# Altium project bolid.PrjPcb (part 2 of 6)

## Sheet bolid-inputs-digital.SchDoc
size A3
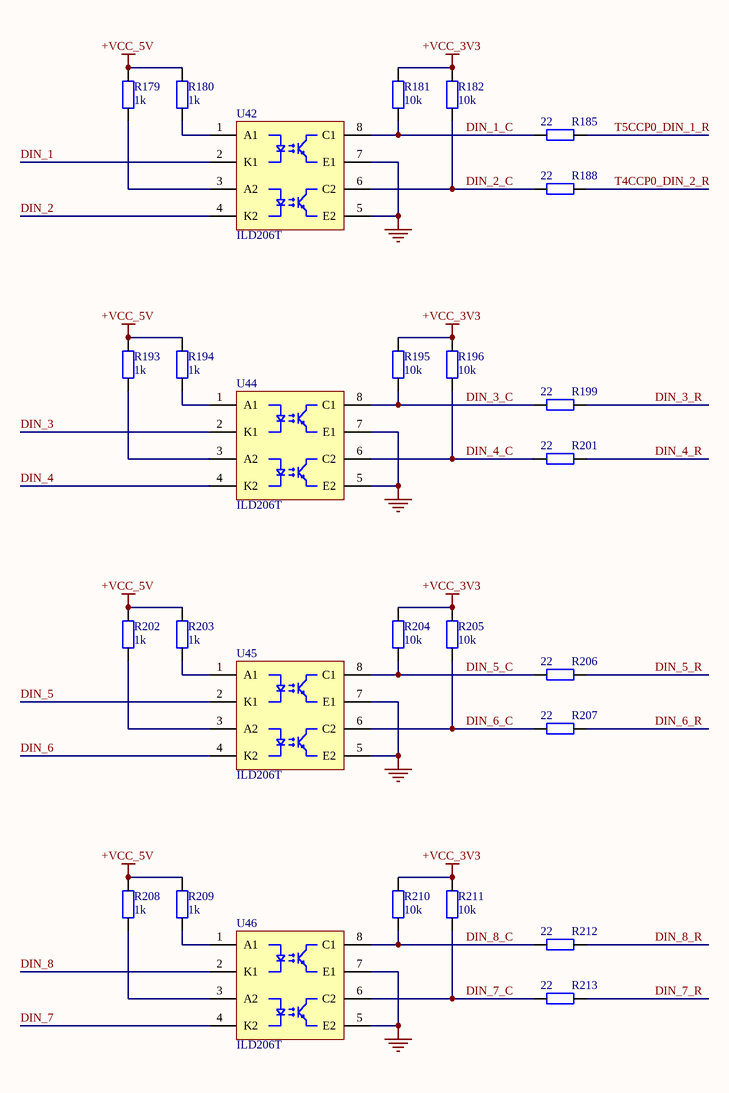
[diagram p2: bolid-inputs-digital.SchDoc]

### Parts
R179  value 1k  [R0402-RESC100X50X40L22N]  (hidden comment: RC0402FR-071KL)
R180  value 1k  [R0402-RESC100X50X40L22N]  (hidden comment: RC0402FR-071KL)
R181  value 10k  [R0402-RESC100X50X40L22N]  (hidden comment: RC0402FR-0710KL)
R182  value 10k  [R0402-RESC100X50X40L22N]  (hidden comment: RC0402FR-0710KL)
R185  value 22  [R0402-RESC100X50X40L22N]  (hidden comment: RC0402FR-1322RL)
R188  value 22  [R0402-RESC100X50X40L22N]  (hidden comment: RC0402FR-1322RL)
R193  value 1k  [R0402-RESC100X50X40L22N]  (hidden comment: RC0402FR-071KL)
R194  value 1k  [R0402-RESC100X50X40L22N]  (hidden comment: RC0402FR-071KL)
R195  value 10k  [R0402-RESC100X50X40L22N]  (hidden comment: RC0402FR-0710KL)
R196  value 10k  [R0402-RESC100X50X40L22N]  (hidden comment: RC0402FR-0710KL)
R199  value 22  [R0402-RESC100X50X40L22N]  (hidden comment: RC0402FR-1322RL)
R201  value 22  [R0402-RESC100X50X40L22N]  (hidden comment: RC0402FR-1322RL)
R202  value 1k  [R0402-RESC100X50X40L22N]  (hidden comment: RC0402FR-071KL)
R203  value 1k  [R0402-RESC100X50X40L22N]  (hidden comment: RC0402FR-071KL)
R204  value 10k  [R0402-RESC100X50X40L22N]  (hidden comment: RC0402FR-0710KL)
R205  value 10k  [R0402-RESC100X50X40L22N]  (hidden comment: RC0402FR-0710KL)
R206  value 22  [R0402-RESC100X50X40L22N]  (hidden comment: RC0402FR-1322RL)
R207  value 22  [R0402-RESC100X50X40L22N]  (hidden comment: RC0402FR-1322RL)
R208  value 1k  [R0402-RESC100X50X40L22N]  (hidden comment: RC0402FR-071KL)
R209  value 1k  [R0402-RESC100X50X40L22N]  (hidden comment: RC0402FR-071KL)
R210  value 10k  [R0402-RESC100X50X40L22N]  (hidden comment: RC0402FR-0710KL)
R211  value 10k  [R0402-RESC100X50X40L22N]  (hidden comment: RC0402FR-0710KL)
R212  value 22  [R0402-RESC100X50X40L22N]  (hidden comment: RC0402FR-1322RL)
R213  value 22  [R0402-RESC100X50X40L22N]  (hidden comment: RC0402FR-1322RL)
U42  ILD206T  [Vishay SOIC8 ILD SOIC8P127_600X610X395L51X41]
U44  ILD206T  [Vishay SOIC8 ILD SOIC8P127_600X610X395L51X41]
U45  ILD206T  [Vishay SOIC8 ILD SOIC8P127_600X610X395L51X41]
U46  ILD206T  [Vishay SOIC8 ILD SOIC8P127_600X610X395L51X41]

### Nets
+VCC_3V3: R181.2 R182.2 R195.2 R196.2 R204.2 R205.2 R210.2 R211.2
+VCC_5V: R179.2 R180.2 R193.2 R194.2 R202.2 R203.2 R208.2 R209.2
GND: U42.5(E2) U42.7(E1) U44.5(E2) U44.7(E1) U45.5(E2) U45.7(E1) U46.5(E2) U46.7(E1)
DIN_1: U42.2(K1)
DIN_1_C: R181.1 R185.1 U42.8(C1)
DIN_2: U42.4(K2)
DIN_2_C: R182.1 R188.1 U42.6(C2)
DIN_3: U44.2(K1)
DIN_3_C: R195.1 R199.1 U44.8(C1)
DIN_3_R: R199.2
DIN_4: U44.4(K2)
DIN_4_C: R196.1 R201.1 U44.6(C2)
DIN_4_R: R201.2
DIN_5: U45.2(K1)
DIN_5_C: R204.1 R206.1 U45.8(C1)
DIN_5_R: R206.2
DIN_6: U45.4(K2)
DIN_6_C: R205.1 R207.1 U45.6(C2)
DIN_6_R: R207.2
DIN_7: U46.4(K2)
DIN_7_C: R211.1 R213.1 U46.6(C2)
DIN_7_R: R213.2
DIN_8: U46.2(K1)
DIN_8_C: R210.1 R212.1 U46.8(C1)
DIN_8_R: R212.2
T4CCP0_DIN_2_R: R188.2
T5CCP0_DIN_1_R: R185.2
NetR179_1: R179.1 U42.3(A2)
NetR180_1: R180.1 U42.1(A1)
NetR193_1: R193.1 U44.3(A2)
NetR194_1: R194.1 U44.1(A1)
NetR202_1: R202.1 U45.3(A2)
NetR203_1: R203.1 U45.1(A1)
NetR208_1: R208.1 U46.3(A2)
NetR209_1: R209.1 U46.1(A1)

### Library data of the parts
R179 R180 R193 R194 R202 R203 R208 R209 = RC0402FR-071KL: RES 0402 (1005) 1.00k 1% 0.0625W 50V Thick Film; Manufacturer: Yageo; Power Rating: 62.5 mW, 125 mW; Resistance: 1 kOhms; Temperature Coefficient: 100 PPM / C; Supplier 1: Mouser; Manufacturer Part Number: RC0402FR-071KL; RoHS: RoHS Compliant; Category: Thick Film Resistors - SMD; Stock 1: 18776448; Pricing 1: 1=0.090, 10=0.011, 100=0.004, 1000=0.003, 10000=0.003 (EUR); Application: High Reliability; Features: -; Height: 0.35 mm; Length: 1 mm; Package / Case: -; Packaging: Cut Tape; Product: Thick Film Resistors SMD; Series: RC; Technology: Thick Film; Termination Style: SMD/SMT; Tolerance: 1 %; Type: General Purpose; Voltage Rating: 50 V; Width: 0.5 mm; Brand: Yageo; Mounting Style: PCB Mount; Case Code - in: 0402; Case Code - mm: 1005; Maximum Operating Temperature: + 155 C; Minimum Operating Temperature: - 55 C; Product Type: Thick Film Resistors; Standard Pack Qty: 10000; Subcategory: Resistors; RoHS - Mouser: Y; Minimum Order Quantity: 1; Reeling: True; ComponentLink1URL: https://www.mouser.com/datasheet/2/447/PYu-RC_Group_51_RoHS_L_10-1664068.pdf; ComponentLink1Description: https://www.mouser.com/datasheet/2/447/PYu-RC_Group_51_RoHS_L_10-1664068.pdf; Supplier Part Number 1: 603-RC0402FR-071KL
R181 R182 R195 R196 R204 R205 R210 R211 = RC0402FR-0710KL: RES 0402 (1005) 10.0k 1% 0.0625W 50V Thick Film; Manufacturer: Yageo; Power Rating: 62.5 mW, 125 mW; Resistance: 10 kOhms; Temperature Coefficient: 100 PPM / C; Supplier 1: Mouser; Manufacturer Part Number: RC0402FR-0710KL; RoHS: RoHS Compliant; Category: Thick Film Resistors - SMD; Stock 1: 20942447; Pricing 1: 1=0.090, 10=0.011, 100=0.004, 1000=0.003, 10000=0.003 (EUR); Application: High Reliability; Features: -; Height: 0.35 mm; Length: 1 mm; Package / Case: -; Packaging: Cut Tape; Product: Thick Film Resistors SMD; Series: RC; Technology: Thick Film; Termination Style: SMD/SMT; Tolerance: 1 %; Type: General Purpose; Voltage Rating: 50 V; Width: 0.5 mm; Brand: Yageo; Mounting Style: PCB Mount; Case Code - in: 0402; Case Code - mm: 1005; Maximum Operating Temperature: + 155 C; Minimum Operating Temperature: - 55 C; Product Type: Thick Film Resistors; Standard Pack Qty: 10000; Subcategory: Resistors; RoHS - Mouser: Y; Minimum Order Quantity: 1; Reeling: True; ComponentLink1URL: https://www.mouser.com/datasheet/2/447/PYu-RC_Group_51_RoHS_L_10-1664068.pdf; ComponentLink1Description: https://www.mouser.com/datasheet/2/447/PYu-RC_Group_51_RoHS_L_10-1664068.pdf; Supplier Part Number 1: 603-RC0402FR-0710KL
R185 R188 R199 R201 R206 R207 R212 R213 = RC0402FR-1322RL: RES 0402 (1005) 22.0 ohm 1% 0.0625W 50V Thick Film; Manufacturer: Yageo; Resistance: 22R; Power Rating: 62.5mW; Temperature Coefficient: 100ppm/°C; Supplier 1: Mouser; Manufacturer Part Number: RC0402FR-1322RL; RoHS: Yes; Category: Chip SMD Resistors; Stock 1: 130563; Pricing 1: 1=0,10000, 10=0,01200, 50=0,01200, 100=0,00500, 1000=0,00300, 10000=0,00300 (USD); Case/Package: 0402; Case Code (Imperial): 0402; Case Code (Metric): 1005; Weight: 2.3E-05oz; Contact Plating: Tin,Matte; Size Code: 0402; Min Operating Temperature: -55°C; Max Operating Temperature: 155°C; Voltage Rating: 50V; Tolerance: 1%; Packaging: Tape and Reel; Resistor Type: Thick Film; Termination: SMD/SMT; Series: RC; Length: 1mm; Width: 0.5mm; Height: 0.35mm; Radiation Hardening: No; Lead Free: Lead Free; RoHS Compliant: Yes; ComponentLink1URL: https://datasheet.ciiva.com/17423/pyu-rc0402-51-rohs-l-6-r-17423721.pdf?src-supplier=Future+Electronics; ComponentLink1Description: https://datasheet.ciiva.com/17423/pyu-rc0402-51-rohs-l-6-r-17423721.pdf?src-supplier=Future+Electronics; ComponentLink2URL: https://datasheet.ciiva.com/8890/pyu-rc0402-51-rohs-l-6-8890187.pdf?src-supplier=Avnet; ComponentLink2Description: https://datasheet.ciiva.com/8890/pyu-rc0402-51-rohs-l-6-8890187.pdf?src-supplier=Avnet; Supplier Part Number 1: 603-RC0402FR-1322RL
U42 U44-U46 = ILD206T: Transistor Output Optocouplers Phototransistor Out Dual CTR 63-125%; Manufacturer: Vishay Semiconductors; Configuration: 2 Channel; Isolation Voltage: 4000 Vrms; Output Type: NPN Phototransistor; Collector-Emitter Breakdown Voltage: 70 V; Current Transfer Ratio: 125 %; If - Forward Current: 30 mA; Maximum Collector Emitter Saturation Voltage: 0.4 V; Pd - Power Dissipation: 300 mW; Vf - Forward Voltage: 1.55 V; Vr - Reverse Voltage: 6 V; Supplier 1: Mouser; Manufacturer Part Number: ILD206T; RoHS: RoHS Compliant; Category: Transistor Output Optocouplers; Stock 1: 3481; Pricing 1: 1=1.22, 10=0.834, 100=0.625, 500=0.512, 1000=0.443, 2000=0.404, 4000=0.394 (EUR); Height: 3.38 mm; Length: 5.84 mm; Package / Case: SOIC-8; Packaging: Cut Tape; Width: 3.91 mm; Brand: Vishay Semiconductors; Mounting Style: SMD/SMT; Number of Channels: 2 Channel; Maximum Collector Emitter Voltage: 70 V; Maximum Operating Temperature: + 100 C; Minimum Operating Temperature: - 55 C; Product Type: Transistor Output Optocouplers; Standard Pack Qty: 2000; Subcategory: Optocouplers; RoHS - Mouser: Y; Minimum Order Quantity: 1; Reeling: True; ComponentLink1URL: https://www.mouser.com/datasheet/2/427/ild205t-244792.pdf; ComponentLink1Description: https://www.mouser.com/datasheet/2/427/ild205t-244792.pdf; Supplier Part Number 1: 782-ILD206T

## Sheet bolid-inputs-hv.SchDoc
size A3
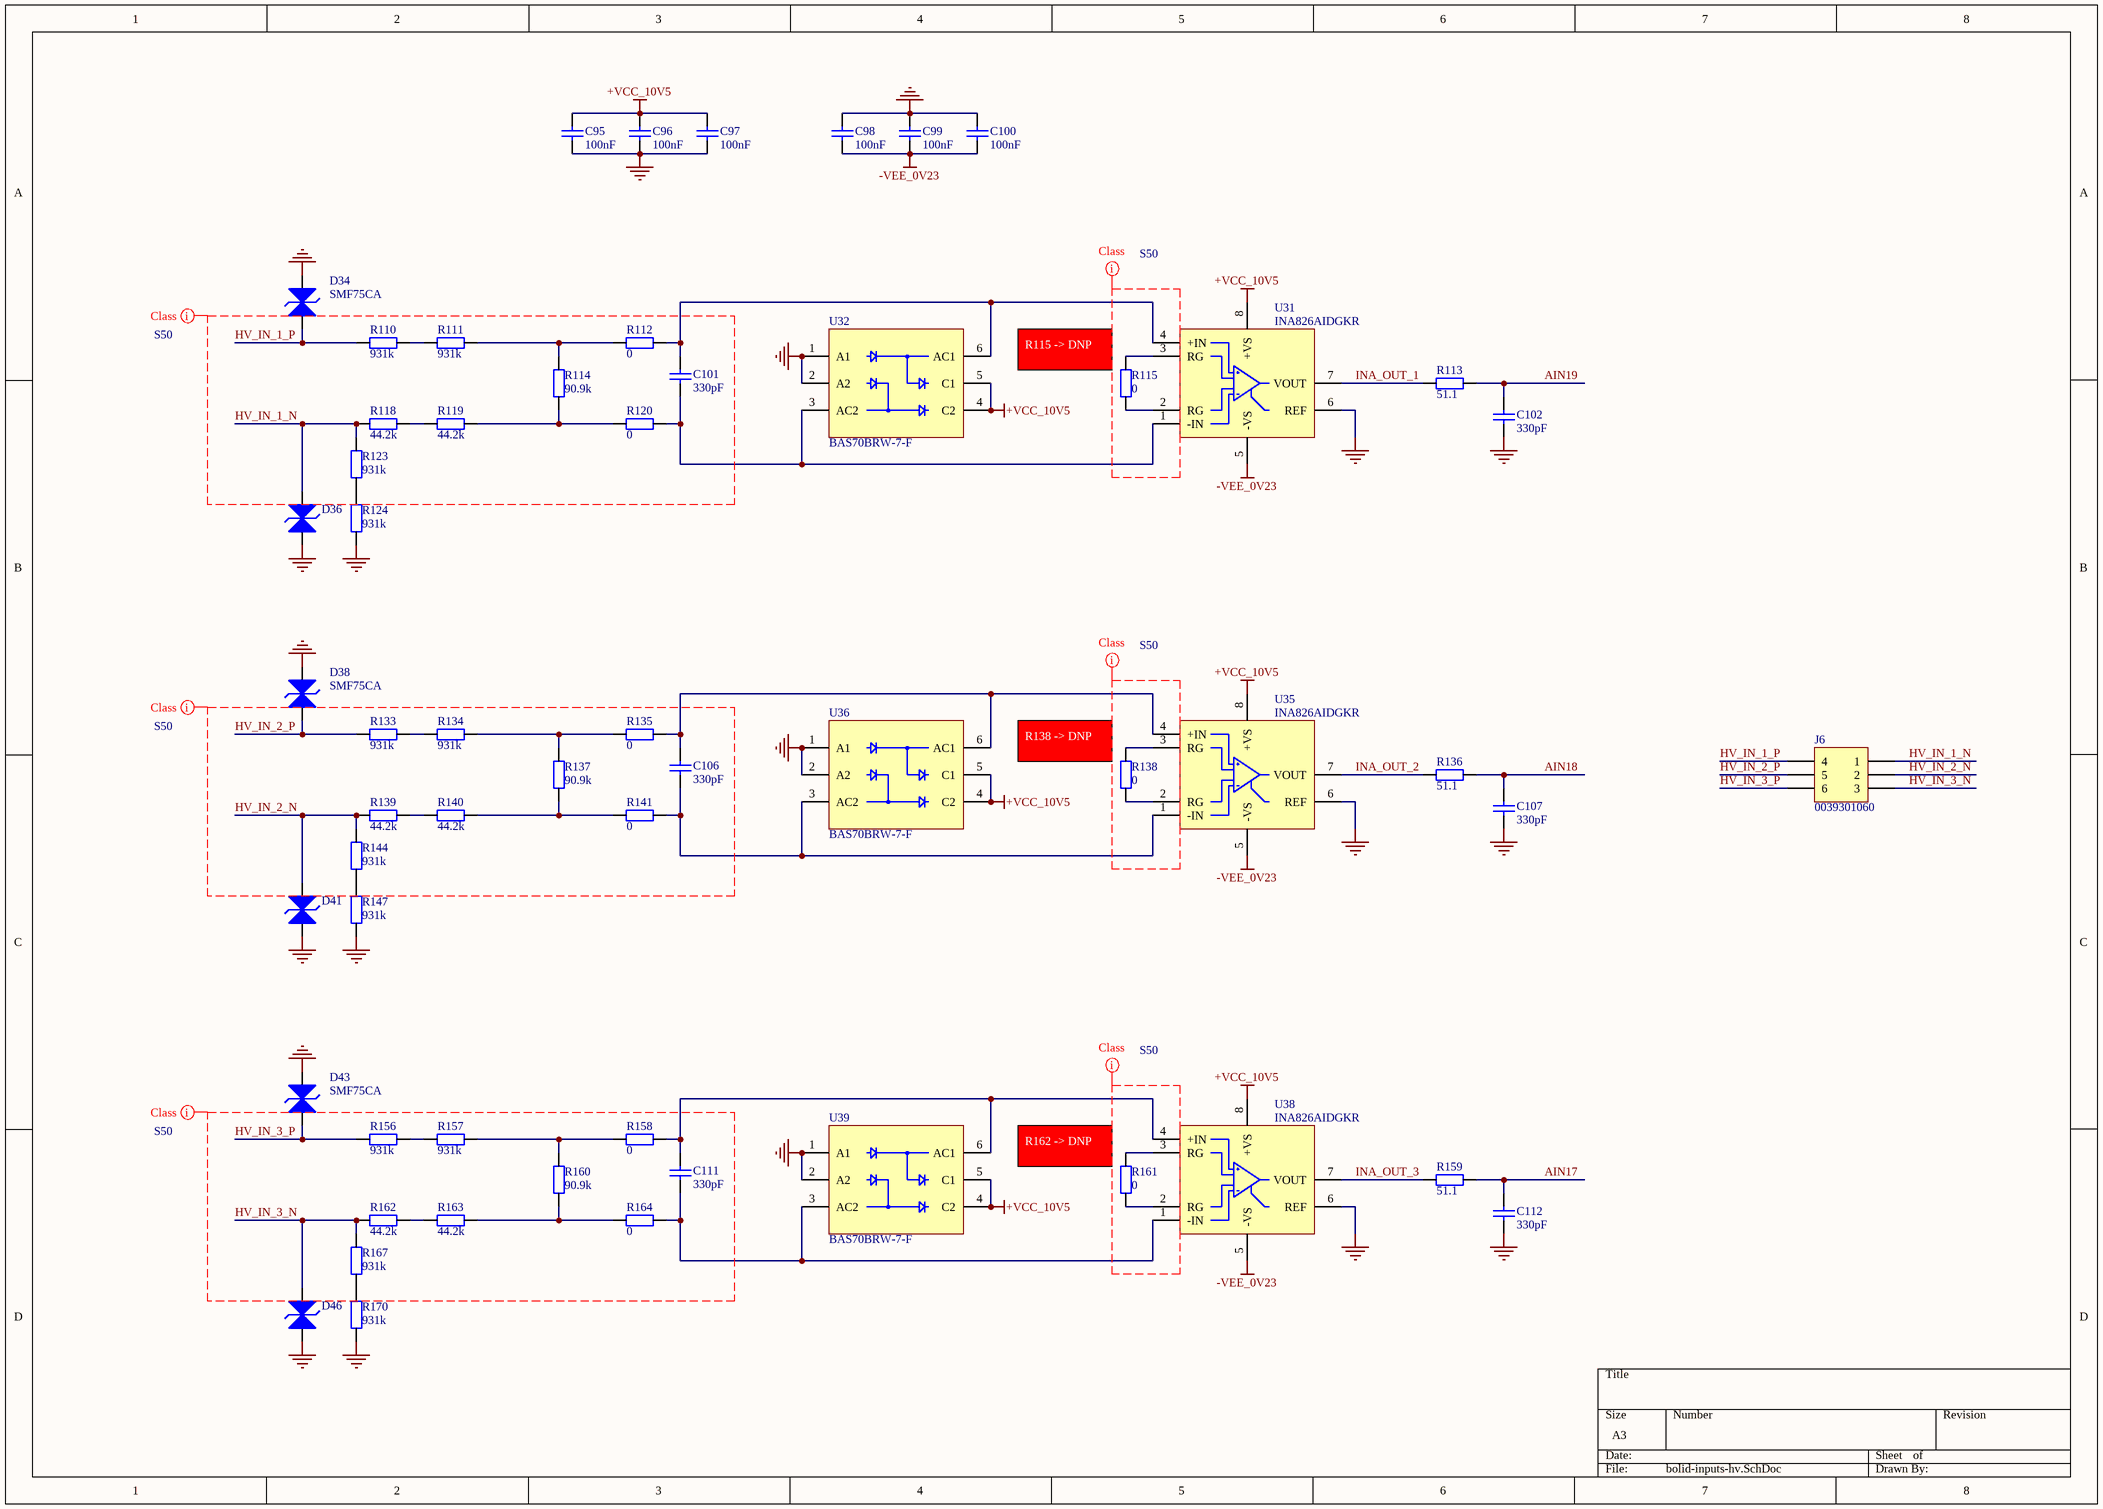
[diagram p3: bolid-inputs-hv.SchDoc]

### Parts
C95  Value Displayed: 100nF  [C0402-CAPC100X50X55L22 - Tayio Yuden TDK]  (hidden comment: GRM155R71H104KE14D)
C96  Value Displayed: 100nF  [C0402-CAPC100X50X55L22 - Tayio Yuden TDK]  (hidden comment: GRM155R71H104KE14D)
C97  Value Displayed: 100nF  [C0402-CAPC100X50X55L22 - Tayio Yuden TDK]  (hidden comment: GRM155R71H104KE14D)
C98  Value Displayed: 100nF  [C0402-CAPC100X50X55L22 - Tayio Yuden TDK]  (hidden comment: GRM155R71H104KE14D)
C99  Value Displayed: 100nF  [C0402-CAPC100X50X55L22 - Tayio Yuden TDK]  (hidden comment: GRM155R71H104KE14D)
C100  Value Displayed: 100nF  [C0402-CAPC100X50X55L22 - Tayio Yuden TDK]  (hidden comment: GRM155R71H104KE14D)
C101  Value Displayed: 330pF  [C0402-CAPC100X50X55L22 - Tayio Yuden TDK]  (hidden comment: C0402C331J5GAC)
C102  Value Displayed: 330pF  [C0402-CAPC100X50X55L22 - Tayio Yuden TDK]  (hidden comment: C0402C331J5GAC)
C106  Value Displayed: 330pF  [C0402-CAPC100X50X55L22 - Tayio Yuden TDK]  (hidden comment: C0402C331J5GAC)
C107  Value Displayed: 330pF  [C0402-CAPC100X50X55L22 - Tayio Yuden TDK]  (hidden comment: C0402C331J5GAC)
C111  Value Displayed: 330pF  [C0402-CAPC100X50X55L22 - Tayio Yuden TDK]  (hidden comment: C0402C331J5GAC)
C112  Value Displayed: 330pF  [C0402-CAPC100X50X55L22 - Tayio Yuden TDK]  (hidden comment: C0402C331J5GAC)
D34  SMF75CA  [SOD-123FL SODFL365X110-2N - BIDIRECTIONAL - Littelfuse]
D36  SMF75CA  [SOD-123FL SODFL365X110-2N - BIDIRECTIONAL - Littelfuse]  (value not drawn)
D38  SMF75CA  [SOD-123FL SODFL365X110-2N - BIDIRECTIONAL - Littelfuse]
D41  SMF75CA  [SOD-123FL SODFL365X110-2N - BIDIRECTIONAL - Littelfuse]  (value not drawn)
D43  SMF75CA  [SOD-123FL SODFL365X110-2N - BIDIRECTIONAL - Littelfuse]
D46  SMF75CA  [SOD-123FL SODFL365X110-2N - BIDIRECTIONAL - Littelfuse]  (value not drawn)
J6  0039301060  [MOLEX Mini-Fit Jr 039301060 2x3 PEG]
R110  value 931k  [R0603-RESC160X80X55L30N]  (hidden comment: RC0603FR-07931KL)
R111  value 931k  [R0603-RESC160X80X55L30N]  (hidden comment: RC0603FR-07931KL)
R112  value 0  [R0402-RESC100X50X40L22N]  (hidden comment: RC0402JR-7D0RL)
R113  value 51.1  [R0402-RESC100X50X40L22N]  (hidden comment: AC0402FR-0751R1L)
R114  value 90.9k  [R0402-RESC100X50X40L22N]  (hidden comment: RC0402FR-0790K9L)
R115  value 0  [R0402-RESC100X50X40L22N]  (hidden comment: RC0402JR-7D0RL)
R118  value 44.2k  [R0603-RESC160X80X55L30N]  (hidden comment: RC0603FR-0744K2L)
R119  value 44.2k  [R0603-RESC160X80X55L30N]  (hidden comment: RC0603FR-0744K2L)
R120  value 0  [R0402-RESC100X50X40L22N]  (hidden comment: RC0402JR-7D0RL)
R123  value 931k  [R0603-RESC160X80X55L30N]  (hidden comment: RC0603FR-07931KL)
R124  value 931k  [R0603-RESC160X80X55L30N]  (hidden comment: RC0603FR-07931KL)
R133  value 931k  [R0603-RESC160X80X55L30N]  (hidden comment: RC0603FR-07931KL)
R134  value 931k  [R0603-RESC160X80X55L30N]  (hidden comment: RC0603FR-07931KL)
R135  value 0  [R0402-RESC100X50X40L22N]  (hidden comment: RC0402JR-7D0RL)
R136  value 51.1  [R0402-RESC100X50X40L22N]  (hidden comment: AC0402FR-0751R1L)
R137  value 90.9k  [R0402-RESC100X50X40L22N]  (hidden comment: RC0402FR-0790K9L)
R138  value 0  [R0402-RESC100X50X40L22N]  (hidden comment: RC0402JR-7D0RL)
R139  value 44.2k  [R0603-RESC160X80X55L30N]  (hidden comment: RC0603FR-0744K2L)
R140  value 44.2k  [R0603-RESC160X80X55L30N]  (hidden comment: RC0603FR-0744K2L)
R141  value 0  [R0402-RESC100X50X40L22N]  (hidden comment: RC0402JR-7D0RL)
R144  value 931k  [R0603-RESC160X80X55L30N]  (hidden comment: RC0603FR-07931KL)
R147  value 931k  [R0603-RESC160X80X55L30N]  (hidden comment: RC0603FR-07931KL)
R156  value 931k  [R0603-RESC160X80X55L30N]  (hidden comment: RC0603FR-07931KL)
R157  value 931k  [R0603-RESC160X80X55L30N]  (hidden comment: RC0603FR-07931KL)
R158  value 0  [R0402-RESC100X50X40L22N]  (hidden comment: RC0402JR-7D0RL)
R159  value 51.1  [R0402-RESC100X50X40L22N]  (hidden comment: AC0402FR-0751R1L)
R160  value 90.9k  [R0402-RESC100X50X40L22N]  (hidden comment: RC0402FR-0790K9L)
R161  value 0  [R0402-RESC100X50X40L22N]  (hidden comment: RC0402JR-7D0RL)
R162  value 44.2k  [R0603-RESC160X80X55L30N]  (hidden comment: RC0603FR-0744K2L)
R163  value 44.2k  [R0603-RESC160X80X55L30N]  (hidden comment: RC0603FR-0744K2L)
R164  value 0  [R0402-RESC100X50X40L22N]  (hidden comment: RC0402JR-7D0RL)
R167  value 931k  [R0603-RESC160X80X55L30N]  (hidden comment: RC0603FR-07931KL)
R170  value 931k  [R0603-RESC160X80X55L30N]  (hidden comment: RC0603FR-07931KL)
U31  INA826AIDGKR  [TI VSSOP8 DGK0008A TSOP65P490X110-8N]
U32  BAS70BRW-7-F  [SOT363 DIODES DS30158 Rev. 14-2 SOT65P210X110-6N]
U35  INA826AIDGKR  [TI VSSOP8 DGK0008A TSOP65P490X110-8N]
U36  BAS70BRW-7-F  [SOT363 DIODES DS30158 Rev. 14-2 SOT65P210X110-6N]
U38  INA826AIDGKR  [TI VSSOP8 DGK0008A TSOP65P490X110-8N]
U39  BAS70BRW-7-F  [SOT363 DIODES DS30158 Rev. 14-2 SOT65P210X110-6N]

### Nets
+VCC_10V5: C95.2 C96.2 C97.2 U31.8(+VS) U32.4(C2) U32.5(C1) U35.8(+VS) U36.4(C2) U36.5(C1) U38.8(+VS) U39.4(C2) U39.5(C1)
-VEE_0V23: C98.1 C99.1 C100.1 U31.5(-VS) U35.5(-VS) U38.5(-VS)
GND: C95.1 C96.1 C97.1 C98.2 C99.2 C100.2 C102.1 C107.1 C112.1 D34.2 D36.1 D38.2 D41.1 D43.2 D46.1 R124.1 R147.1 R170.1 U31.6(REF) U32.1(A1) U32.2(A2) U35.6(REF) U36.1(A1) U36.2(A2) U38.6(REF) U39.1(A1) U39.2(A2)
AIN17: C112.2 R159.2
AIN18: C107.2 R136.2
AIN19: C102.2 R113.2
HV_IN_1_N: D36.2 J6.1 R118.1 R123.2
HV_IN_1_P: D34.1 J6.4 R110.1
HV_IN_2_N: D41.2 J6.2 R139.1 R144.2
HV_IN_2_P: D38.1 J6.5 R133.1
HV_IN_3_N: D46.2 J6.3 R162.1 R167.2
HV_IN_3_P: D43.1 J6.6 R156.1
INA_OUT_1: R113.1 U31.7(VOUT)
INA_OUT_2: R136.1 U35.7(VOUT)
INA_OUT_3: R159.1 U38.7(VOUT)
NetC101_1: C101.1 R120.1 U31.1(-IN) U32.3(AC2)
NetC101_2: C101.2 R112.1 U31.4(+IN) U32.6(AC1)
NetC106_1: C106.1 R141.1 U35.1(-IN) U36.3(AC2)
NetC106_2: C106.2 R135.1 U35.4(+IN) U36.6(AC1)
NetC111_1: C111.1 R164.1 U38.1(-IN) U39.3(AC2)
NetC111_2: C111.2 R158.1 U38.4(+IN) U39.6(AC1)
NetR110_2: R110.2 R111.1
NetR111_2: R111.2 R112.2 R114.2
NetR114_1: R114.1 R119.2 R120.2
NetR115_1: R115.1 U31.2(RG)
NetR115_2: R115.2 U31.3(RG)
NetR118_2: R118.2 R119.1
NetR123_1: R123.1 R124.2
NetR133_2: R133.2 R134.1
NetR134_2: R134.2 R135.2 R137.2
NetR137_1: R137.1 R140.2 R141.2
NetR138_1: R138.1 U35.2(RG)
NetR138_2: R138.2 U35.3(RG)
NetR139_2: R139.2 R140.1
NetR144_1: R144.1 R147.2
NetR156_2: R156.2 R157.1
NetR157_2: R157.2 R158.2 R160.2
NetR160_1: R160.1 R163.2 R164.2
NetR161_1: R161.1 U38.2(RG)
NetR161_2: R161.2 U38.3(RG)
NetR162_2: R162.2 R163.1
NetR167_1: R167.1 R170.2

### Layout directives
net class S50: (no net found under the mark), HV_IN_1_N, HV_IN_1_P, HV_IN_2_N, HV_IN_2_P, HV_IN_3_N, HV_IN_3_P

### Notes on the sheet
- (near R115) R115 -> DNP
- (near R138) R138 -> DNP
- (near R161) R162 -> DNP

### Library data of the parts
C95-C100 = GRM155R71H104KE14D: MLCC 0402 (1005) 100nF 10% 50V X7R; Manufacturer: Murata Electronics; Capacitance: 0.1 uF; Type: Chip Multilayer Ceramic Capacitor for General Purpose; Voltage Rating DC: 50 VDC; Capacitance - pF: 100000 pF; Class: Class 2; Supplier 1: Mouser; Manufacturer Part Number: GRM155R71H104KE14D; RoHS: RoHS Compliant; Category: Multilayer Ceramic Capacitors MLCC - SMD/SMT; Stock 1: 3511637; Pricing 1: 1=0.090, 10=0.038, 100=0.016, 500=0.012, 1000=0.009, 2500=0.008, 5000=0.007, 10000=0.005 (EUR); Height: 0.5 mm; Length: 1 mm; Package / Case: 0402 (1005 metric); Packaging: Cut Tape; Product: General Type MLCCs; Series: GRM; Termination Style: SMD/SMT; Tolerance: 10 %; Width: 0.5 mm; Brand: Murata Electronics; Capacitance - nF: 100 nF; Case Code - in: 0402; Case Code - mm: 1005; Dielectric: X7R; Maximum Operating Temperature: + 125 C; Minimum Operating Temperature: - 55 C; Product Type: Ceramic Capacitors; Standard Pack Qty: 10000; Subcategory: Capacitors; Termination: Standard; RoHS - Mouser: Y; Minimum Order Quantity: 1; Reeling: True; ComponentLink1URL: https://www.mouser.com/datasheet/2/281/murata_03052018_GRM_Series_1-1310166.pdf; ComponentLink1Description: https://www.mouser.com/datasheet/2/281/murata_03052018_GRM_Series_1-1310166.pdf; Value: 100nF; Supplier Part Number 1: 81-GRM155R71H104KE4D
C101 C102 C106 C107 C111 C112 = C0402C331J5GAC: MLCC 0402 (1005) 330pF 5% 50V C0G (N0P); Manufacturer: KEMET; Dielectric Material: Ceramic; Dissipation Factor: 0.1%; Value: 330p; Supplier 1: Mouser; Manufacturer Part Number: C0402C331J5GAC; RoHS: Yes; Category: Ceramic Capacitors; Stock 1: 30000; Pricing 1: 10000=0,08600 (USD); Case/Package: 0402; Case Code (Imperial): 0402; Case Code (Metric): 1005; Min Operating Temperature: -55°C; Max Operating Temperature: 125°C; Capacitance: 330pF; Voltage Rating (DC): 50V; Tolerance: 5%; Package Quantity: 10000; Voltage Rating: 50V; Packaging: Tape and Reel; Dielectric: C0G; Termination: SMD/SMT; Series: C0402C; Length: 1mm; Width: 0.5mm; Height: 0.5mm; Lead Free: Lead Free; RoHS Compliant: Yes; ComponentLink1URL: https://datasheet.ciiva.com/13387/kem-c1003-c0g-smd-356956-13387134.pdf?src-supplier=Mouser; ComponentLink1Description: https://datasheet.ciiva.com/13387/kem-c1003-c0g-smd-356956-13387134.pdf?src-supplier=Mouser; Supplier Part Number 1: 80-C0402C331J5GAC
D34 D36 D38 D41 D43 D46 = SMF75CA: Manufacturer: Littelfuse; Supplier 1: Mouser; Manufacturer Part Number: SMF75CA; RoHS: Yes; Stock 1: 3903; Pricing 1: 1=0,4, 10=0,271, 50=0,271, 100=0,134, 1000=0,121, 10000=0,098 (USD); Supplier Part Number 1: 576-SMF75CA
J6 = 039301060: Molex MiniFit Jr 2x3 Peg Rt Angle Header Tin Plate W/pcb Mount Peg 94V-2 6 Circuit | Molex Incorporated 39-30-1060; Supplier 1: Mouser; Manufacturer: Molex; Manufacturer Part Number: 0039301060; RoHS: Yes; Stock 1: 11572; Pricing 1: 1=0,89, 10=0,554, 50=0,554, 100=0,482, 1000=0,481, 10000=0,463 (USD); Supplier Part Number 1: 538-39-30-1060
R110 R111 R123 R124 R133 R134 R144 R147 R156 R157 R167 R170 = RC0603FR-07931KL: RES 0603 (1608) 931.0k 1% 0.100W 50V Thick Film; Manufacturer: Yageo; Supplier 1: Mouser; Manufacturer Part Number: RC0603FR-07931KL; RoHS: Yes; Category: Chip SMD Resistors; Stock 1: 15576; Pricing 1: 1=0,1, 10=0,01, 50=0,01, 100=0,007, 1000=0,005, 10000=0,004 (USD); Voltage Rating (DC): 50V; Lead Free: 5697LeadFree; ComponentLink1URL: https://datasheet.ciiva.com/2454/pyu-r-int-thick-7-2454555.pdf?src-supplier=Digikey; ComponentLink1Description: https://datasheet.ciiva.com/2454/pyu-r-int-thick-7-2454555.pdf?src-supplier=Digikey; ComponentLink2URL: https://datasheet.ciiva.com/2454/pyu-r-int-thick-7-2454556.pdf?src-supplier=Digikey; ComponentLink2Description: https://datasheet.ciiva.com/2454/pyu-r-int-thick-7-2454556.pdf?src-supplier=Digikey; ComponentLink3URL: https://datasheet.ciiva.com/2454/pyu-r-int-thick-7-2454557.pdf?src-supplier=Digikey; ComponentLink3Description: https://datasheet.ciiva.com/2454/pyu-r-int-thick-7-2454557.pdf?src-supplier=Digikey; ComponentLink4URL: https://datasheet.ciiva.com/12575/rc0603-272842-12575067.pdf?src-supplier=Mouser; ComponentLink4Description: https://datasheet.ciiva.com/12575/rc0603-272842-12575067.pdf?src-supplier=Mouser; Supplier Part Number 1: 603-RC0603FR-07931KL
R112 R115 R120 R135 R138 R141 R158 R161 R164 = RC0402JR-7D0RL: RES 0402 (1005) 0.00 ohm 1% 0.0625W 50V Thick Film; Manufacturer: Yageo; Resistance: 0mR; Tolerance: 5%; Supplier 1: Mouser; Manufacturer Part Number: RC0402JR-7D0RL; RoHS: Yes; Category: Chip SMD Resistors; Stock 1: 114874; Pricing 1: 1=0,10000, 10=0,01400, 50=0,01400, 100=0,00600, 1000=0,00300, 10000=0,00200 (USD); Case/Package: 0402; RoHS Compliant: Yes; Supplier Part Number 1: 603-RC0402JR-7D0RL
R113 R136 R159 = AC0402FR-0751R1L: RES 0402 (1005) 51.1 ohm 1% 0.0625W 50V Thick Film; Manufacturer: Yageo; Power Rating: 62.5mW; Resistance: 51.1R; Max Power Dissipation: 63mW; Temperature Coefficient: 100ppm/°C; Supplier 1: Mouser; Manufacturer Part Number: AC0402FR-0751R1L; RoHS: Yes; Category: Chip SMD Resistors; Stock 1: 57995; Pricing 1: 1=0,10000, 10=0,01500, 50=0,01500, 100=0,00700, 1000=0,00300, 10000=0,00200 (USD); Case/Package: 0402; Case Code (Imperial): 0402; Case Code (Metric): 1005; Min Operating Temperature: -55°C; Max Operating Temperature: 155°C; Packaging: Tape and Reel; Tolerance: 1%; Voltage Rating: 50V; Resistor Type: Thick Film; Number of Terminations: 2; Termination: SMD/SMT; Features: Moisture Resistant,Automotive AEC-Q200; Series: AC; Length: 0.039inch; Width: 0.02inch; Height: 0.015inch; RoHS Compliant: Yes; ComponentLink1URL: http://www.mouser.com/ds/2/447/yageodocoutput-1111992.pdf?src-supplier=Mouser; ComponentLink1Description: http://www.mouser.com/ds/2/447/yageodocoutput-1111992.pdf?src-supplier=Mouser; ComponentLink2URL: http://www.yageo.com/NewPortal/yageodocoutput?fileName=/pdf/R-Chip/PYu-AC_51_RoHS_L_6.pdf&src-supplier=Digi-Key; ComponentLink2Description: http://www.yageo.com/NewPortal/yageodocoutput?fileName=/pdf/R-Chip/PYu-AC_51_RoHS_L_6.pdf&src-supplier=Digi-Key; Supplier Part Number 1: 603-AC0402FR-0751R1L
R114 R137 R160 = RC0402FR-0790K9L: RES 0402 (1005) 90.9k 1% 0.0625W 50V Thick Film; Manufacturer: YAGEO; Power Rating: 62.5 mW (1/16 W); Resistance: 90.9 kOhms; Temperature Coefficient: 100 PPM / C; Supplier 1: Mouser; Manufacturer Part Number: RC0402FR-0790K9L; RoHS: RoHS Compliant By Exemption; Category: Thick Film Resistors - SMD; Stock 1: 41956; Pricing 1: 1=0.088, 10=0.014, 100=0.006, 1000=0.003, 10000=0.001 (EUR); Application: High Reliability; Features: -; Height: 0.35 mm; Length: 1 mm; Packaging: Cut Tape; Product: Thick Film Resistors SMD; Series: RC; Technology: Thick Film; Termination Style: SMD/SMT; Tolerance: 1 %; Type: General Purpose; Voltage Rating: 50 V; Width: 0.5 mm; Brand: YAGEO; Mounting Style: PCB Mount; Case Code - in: 0402; Case Code - mm: 1005; Maximum Operating Temperature: + 155 C; Minimum Operating Temperature: - 55 C; Product Type: Thick Film Resistors; Standard Pack Qty: 10000; Subcategory: Resistors; RoHS - Mouser: E; Minimum Order Quantity: 1; Reeling: True; ComponentLink1URL: https://www.mouser.com/datasheet/2/447/PYu_RC_Group_51_RoHS_L_10-1664068.pdf; ComponentLink1Description: https://www.mouser.com/datasheet/2/447/PYu_RC_Group_51_RoHS_L_10-1664068.pdf; Supplier Part Number 1: 603-RC0402FR-0790K9L
R118 R119 R139 R140 R162 R163 = RC0603FR-0744K2L: RES 0603 (1608) 44.2k 1% 0.100W 50V Thick Film; Manufacturer: Yageo; Supplier 1: Mouser; Manufacturer Part Number: RC0603FR-0744K2L; RoHS: Yes; Category: Chip SMD Resistors; Stock 1: 19002; Pricing 1: 1=0,1, 10=0,012, 50=0,012, 100=0,007, 1000=0,005, 10000=0,003 (USD); Voltage Rating (DC): 50V; Lead Free: 5697LeadFree; ComponentLink1URL: https://datasheet.ciiva.com/11819/0900766b80f96399-11819371.pdf?src-supplier=Rs; ComponentLink1Description: https://datasheet.ciiva.com/11819/0900766b80f96399-11819371.pdf?src-supplier=Rs; ComponentLink2URL: https://datasheet.ciiva.com/2455/pyu-r-int-thick-7-2455152.pdf?src-supplier=Digikey; ComponentLink2Description: https://datasheet.ciiva.com/2455/pyu-r-int-thick-7-2455152.pdf?src-supplier=Digikey; ComponentLink3URL: https://datasheet.ciiva.com/2455/pyu-r-int-thick-7-2455153.pdf?src-supplier=Digikey; ComponentLink3Description: https://datasheet.ciiva.com/2455/pyu-r-int-thick-7-2455153.pdf?src-supplier=Digikey; ComponentLink4URL: https://datasheet.ciiva.com/2455/pyu-r-int-thick-7-2455154.pdf?src-supplier=Digikey; ComponentLink4Description: https://datasheet.ciiva.com/2455/pyu-r-int-thick-7-2455154.pdf?src-supplier=Digikey; Supplier Part Number 1: 603-RC0603FR-0744K2L
U31 U35 U38 = INA826AIDGKR: Precision, 200-μA Supply Current, 36-V Supply Instrumentation Amplifier 8-VSSOP -40 to 125; Manufacturer: Texas Instruments; Resistance: 100kR; Supplier 1: Mouser; Manufacturer Part Number: INA826AIDGKR; RoHS: Yes; Category: Amplifiers - Op Amps, Buffer, Instrumentation; Stock 1: 18608; Pricing 1: 1=2,95, 10=2,03, 50=2,03, 100=1,79, 1000=1,52, 10000=1,4 (USD); Length: 3mm; Width: 3mm; Height: 1.07mm; Thickness: 970um; ComponentLink1URL: https://datasheet.ciiva.com/1798/ina826-1798294.pdf?src-supplier=Digikey; ComponentLink1Description: https://datasheet.ciiva.com/1798/ina826-1798294.pdf?src-supplier=Digikey; ComponentLink2URL: https://datasheet.ciiva.com/1798/ina826-1798295.pdf?src-supplier=Digikey; ComponentLink2Description: https://datasheet.ciiva.com/1798/ina826-1798295.pdf?src-supplier=Digikey; ComponentLink3URL: https://datasheet.ciiva.com/1798/ina826-1798296.pdf?src-supplier=Digikey; ComponentLink3Description: https://datasheet.ciiva.com/1798/ina826-1798296.pdf?src-supplier=Digikey; ComponentLink4URL: https://datasheet.ciiva.com/14338/ina826-14338024.pdf?src-supplier=Avnet; ComponentLink4Description: https://datasheet.ciiva.com/14338/ina826-14338024.pdf?src-supplier=Avnet; ComponentLink5URL: https://datasheet.ciiva.com/1487/1806064-1487618.pdf?src-supplier=Element14; ComponentLink5Description: https://datasheet.ciiva.com/1487/1806064-1487618.pdf?src-supplier=Element14; Supplier Part Number 1: 595-INA826AIDGKR
U32 U36 U39 = BAS70BRW-7-F: BAS70BRW Series 70 V 100 mA Surface Mount Schottky Barrier Diode Arrays SOT-363; Manufacturer: Diodes; Forward Current: 70mA; Max Reverse Current: 100nA; Forward Voltage: 1V; Max Power Dissipation: 200mW; Reverse Recovery Time: 5ns; Max Repetitive Reverse Voltage (Vrrm): 70V; Peak Non-Repetitive Surge Current: 100mA; Capacitance: 2pF; Supplier 1: Mouser; Manufacturer Part Number: BAS70BRW-7-F; RoHS: Yes; Category: Schottky Diodes; Stock 1: 23365; Pricing 1: 1=0,62000, 10=0,53000, 50=0,53000, 100=0,39600, 1000=0,24100, 10000=0,19700 (USD); Mount: Surface Mount; Case/Package: SOT-363; Number of Pins: 6; Weight: 0.000212oz; Contact Plating: Tin,Matte; Min Operating Temperature: -55°C; Max Operating Temperature: 125°C; Package Quantity: 3000; Packaging: Tape and Reel; Average Rectified Current: 70mA; Power Dissipation: 200mW; Termination: SMD/SMT; Max Forward Surge Current (Ifsm): 100mA; Current Rating: 70mA; Power Rating: 200mW; Voltage Rating (DC): 70V; Max Reverse Voltage (DC): 70V; Series: -; Length: 2.2mm; Width: 1.35mm; Height: 1mm; Radiation Hardening: No; Lead Free: Lead Free; RoHS Compliant: Yes; ComponentLink1URL: https://datasheet.ciiva.com/26949/getdatasheetpartid-202320-26949402.pdf?src-supplier=Verical; ComponentLink1Description: https://datasheet.ciiva.com/26949/getdatasheetpartid-202320-26949402.pdf?src-supplier=Verical; Supplier Part Number 1: 621-BAS70BRW-7-F

## Sheet bolid-outputs.SchDoc
size A3
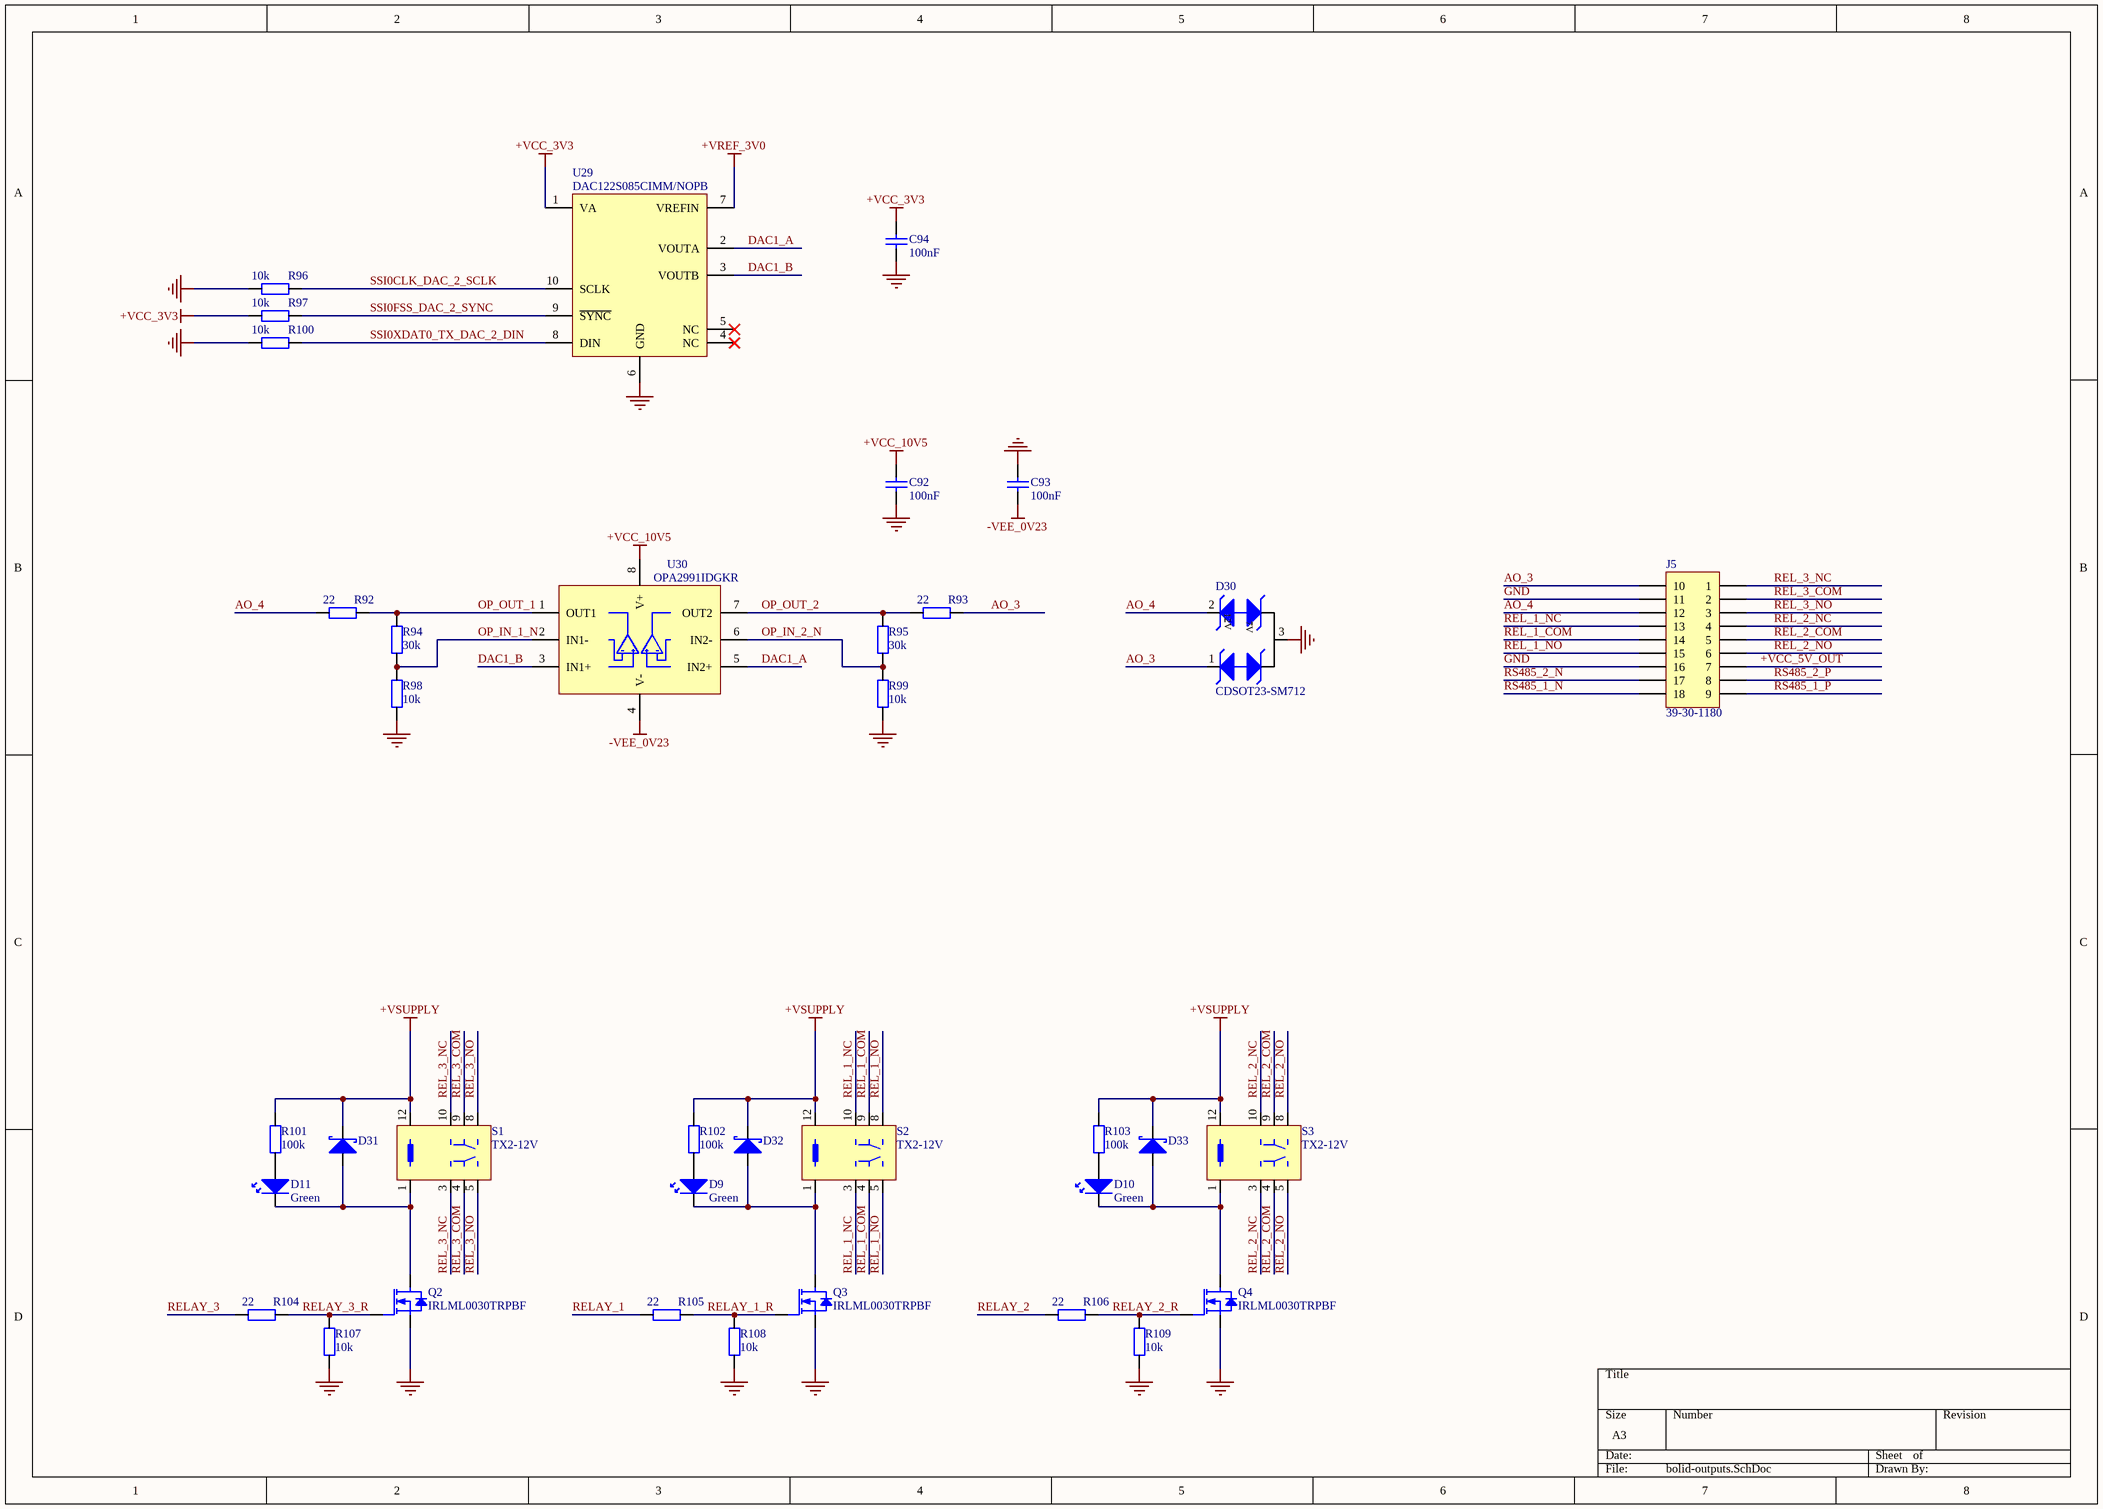
[diagram p4: bolid-outputs.SchDoc]

### Parts
C92  Value Displayed: 100nF  [C0402-CAPC100X50X55L22 - Tayio Yuden TDK]  (hidden comment: GRM155R71H104KE14D)
C93  Value Displayed: 100nF  [C0402-CAPC100X50X55L22 - Tayio Yuden TDK]  (hidden comment: GRM155R71H104KE14D)
C94  Value Displayed: 100nF  [C0402-CAPC100X50X55L22 - Tayio Yuden TDK]  (hidden comment: GRM155R71H104KE14D)
D9  Illumination Color: Green  [D0603 DIONC166X84X36L42N Littelfuse]  (hidden comment: 150060GS75000)
D10  Illumination Color: Green  [D0603 DIONC166X84X36L42N Littelfuse]  (hidden comment: 150060GS75000)
D11  Illumination Color: Green  [D0603 DIONC166X84X36L42N Littelfuse]  (hidden comment: 150060GS75000)
D30  CDSOT23-SM712  [Bourns SOT-23-3L SOT23-3P95_229X117L49X40N]
D31  MBR0530T3G  [SOD-123-2L SOD375X160X128L32X60N - Fairchild]  (value not drawn)
D32  MBR0530T3G  [SOD-123-2L SOD375X160X128L32X60N - Fairchild]  (value not drawn)
D33  MBR0530T3G  [SOD-123-2L SOD375X160X128L32X60N - Fairchild]  (value not drawn)
J5  39-30-1180  [MOLEX Mini-Fit Jr 039301180 2x9 PEG]
Q2  IRLML0030TRPBF  [SOT23-3P95_237X112L50X40N - Infineon Micro3]
Q3  IRLML0030TRPBF  [SOT23-3P95_237X112L50X40N - Infineon Micro3]
Q4  IRLML0030TRPBF  [SOT23-3P95_237X112L50X40N - Infineon Micro3]
R92  value 22  [R0402-RESC100X50X40L22N]  (hidden comment: RC0402FR-1322RL)
R93  value 22  [R0402-RESC100X50X40L22N]  (hidden comment: RC0402FR-1322RL)
R94  value 30k  [R0402-RESC100X50X40L22N]  (hidden comment: RC0402FR-1330KL)
R95  value 30k  [R0402-RESC100X50X40L22N]  (hidden comment: RC0402FR-1330KL)
R96  value 10k  [R0402-RESC100X50X40L22N]  (hidden comment: RC0402FR-0710KL)
R97  value 10k  [R0402-RESC100X50X40L22N]  (hidden comment: RC0402FR-0710KL)
R98  value 10k  [R0402-RESC100X50X40L22N]  (hidden comment: RC0402FR-0710KL)
R99  value 10k  [R0402-RESC100X50X40L22N]  (hidden comment: RC0402FR-0710KL)
R100  value 10k  [R0402-RESC100X50X40L22N]  (hidden comment: RC0402FR-0710KL)
R101  value 100k  [R0402-RESC100X50X40L22N]  (hidden comment: RC0402FR-07100KL)
R102  value 100k  [R0402-RESC100X50X40L22N]  (hidden comment: RC0402FR-07100KL)
R103  value 100k  [R0402-RESC100X50X40L22N]  (hidden comment: RC0402FR-07100KL)
R104  value 22  [R0402-RESC100X50X40L22N]  (hidden comment: RC0402FR-1322RL)
R105  value 22  [R0402-RESC100X50X40L22N]  (hidden comment: RC0402FR-1322RL)
R106  value 22  [R0402-RESC100X50X40L22N]  (hidden comment: RC0402FR-1322RL)
R107  value 10k  [R0402-RESC100X50X40L22N]  (hidden comment: RC0402FR-0710KL)
R108  value 10k  [R0402-RESC100X50X40L22N]  (hidden comment: RC0402FR-0710KL)
R109  value 10k  [R0402-RESC100X50X40L22N]  (hidden comment: RC0402FR-0710KL)
S1  TX2-12V  [NAiS_TX2]
S2  TX2-12V  [NAiS_TX2]
S3  TX2-12V  [NAiS_TX2]
U29  DAC122S085CIMM/NOPB  [TI VSSOP10 DGS0010A TSSOP50P490X110-10N]
U30  OPA2991IDGKR  [TI VSSOP8 DGK0008A TSOP65P490X110-8N]

### Nets
+VCC_3V3: C94.2 R97.2 U29.1(VA)
+VCC_5V_OUT: J5.7
+VCC_10V5: C92.2 U30.8(V+)
+VREF_3V0: U29.7(VREFIN)
+VSUPPLY: D31.1(K) D32.1(K) D33.1(K) R101.2 R102.2 R103.2 S1.12 S2.12 S3.12
-VEE_0V23: C93.1 U30.4(V-)
GND: C92.1 C93.2 C94.1 D30.3 J5.11 J5.16 Q2.2(S) Q3.2(S) Q4.2(S) R96.2 R98.1 R99.1 R100.2 R107.1 R108.1 R109.1 U29.6(GND)
AO_3: D30.1 J5.10 R93.2
AO_4: D30.2 J5.12 R92.1
DAC1_A: U29.2(VOUTA) U30.5(IN2+)
DAC1_B: U29.3(VOUTB) U30.3(IN1+)
OP_IN_1_N: R94.1 R98.2 U30.2(IN1-)
OP_IN_2_N: R95.1 R99.2 U30.6(IN2-)
OP_OUT_1: R92.2 R94.2 U30.1(OUT1)
OP_OUT_2: R93.1 R95.2 U30.7(OUT2)
REL_1_COM: J5.14 S2.4 S2.9
REL_1_NC: J5.13 S2.3 S2.10
REL_1_NO: J5.15 S2.5 S2.8
REL_2_COM: J5.5 S3.4 S3.9
REL_2_NC: J5.4 S3.3 S3.10
REL_2_NO: J5.6 S3.5 S3.8
REL_3_COM: J5.2 S1.4 S1.9
REL_3_NC: J5.1 S1.3 S1.10
REL_3_NO: J5.3 S1.5 S1.8
RELAY_1: R105.1
RELAY_1_R: Q3.1(G) R105.2 R108.2
RELAY_2: R106.1
RELAY_2_R: Q4.1(G) R106.2 R109.2
RELAY_3: R104.1
RELAY_3_R: Q2.1(G) R104.2 R107.2
RS485_1_N: J5.18
RS485_1_P: J5.9
RS485_2_N: J5.17
RS485_2_P: J5.8
SSI0CLK_DAC_2_SCLK: R96.1 U29.10(SCLK)
SSI0FSS_DAC_2_SYNC: R97.1 U29.9(~{SYNC})
SSI0XDAT0_TX_DAC_2_DIN: R100.1 U29.8(DIN)
NetD9_1: D9.1(K) D32.2(A) Q3.3(D) S2.1
NetD9_2: D9.2(A) R102.1
NetD10_1: D10.1(K) D33.2(A) Q4.3(D) S3.1
NetD10_2: D10.2(A) R103.1
NetD11_1: D11.1(K) D31.2(A) Q2.3(D) S1.1
NetD11_2: D11.2(A) R101.1

Not connected (* = marked no-connect by the designer): U29 4(NC)* 5(NC)*

### Notes on the sheet
- (in symbol CDSOT23-SM712) 7V

### Library data of the parts
C92-C94 = GRM155R71H104KE14D: as C95 on sheet bolid-inputs-hv; Supplier 1: Mouser; Manufacturer Part Number: GRM155R71H104KE14D; RoHS: RoHS Compliant; Category: Multilayer Ceramic Capacitors MLCC - SMD/SMT; Stock 1: 3511637; Pricing 1: 1=0.090, 10=0.038, 100=0.016, 500=0.012, 1000=0.009, 2500=0.008, 5000=0.007, 10000=0.005 (EUR); Height: 0.5 mm; Length: 1 mm; Package / Case: 0402 (1005 metric); Packaging: Cut Tape; Product: General Type MLCCs; Series: GRM; Termination Style: SMD/SMT; Tolerance: 10 %; Width: 0.5 mm; Brand: Murata Electronics; Capacitance - nF: 100 nF; Case Code - in: 0402; Case Code - mm: 1005; Dielectric: X7R; Maximum Operating Temperature: + 125 C; Minimum Operating Temperature: - 55 C; Product Type: Ceramic Capacitors; Standard Pack Qty: 10000; Subcategory: Capacitors; Termination: Standard; RoHS - Mouser: Y; Minimum Order Quantity: 1; Reeling: True; ComponentLink1URL: https://www.mouser.com/datasheet/2/281/murata_03052018_GRM_Series_1-1310166.pdf; ComponentLink1Description: https://www.mouser.com/datasheet/2/281/murata_03052018_GRM_Series_1-1310166.pdf; Value: 100nF; Supplier Part Number 1: 81-GRM155R71H104KE4D
D9-D11 = 150060GS75000: LED 0603 (1608) Green; Manufacturer: Wurth Elektronik; Lens Color/Style: Water Clear; Power Rating: 105 mW; Lens Shape: Rectangular; Luminous Intensity: 430 mcd; Peak Wavelength: 515 nm; Viewing Angle: 140 deg; If - Forward Current: 20 mA; Vf - Forward Voltage: 3.2 V; Vr - Reverse Voltage: 5 V; Wavelength/Color Temperature: 520 nm; Supplier 1: Mouser; Manufacturer Part Number: 150060GS75000; RoHS: RoHS Compliant; Category: Standard LEDs - SMD; Stock 1: 17312; Pricing 1: 1=0.130, 10=0.126, 50=0.115, 100=0.099, 500=0.085, 4000=0.085 (EUR); Height: 0.7 mm; Length: 1.6 mm; Package / Case: 0603 (1608 metric); Packaging: Cut Tape; Product: Green LEDs; Series: WL-SMCW; Width: 0.8 mm; Brand: Wurth Elektronik; Mounting Style: SMD/SMT; Lens Dimensions: 1.1 mm x 0.8 mm; Lens Transparency: Water Clear; Maximum Operating Temperature: + 85 C; Minimum Operating Temperature: - 40 C; Moisture Sensitive: Yes; Product Type: LED - Standard; Standard Pack Qty: 4000; Subcategory: LEDs; RoHS - Mouser: Y; Minimum Order Quantity: 1; Reeling: True; ComponentLink1URL: https://www.mouser.com/datasheet/2/445/150060GS75000-368921.pdf; ComponentLink1Description: https://www.mouser.com/datasheet/2/445/150060GS75000-368921.pdf; Supplier Part Number 1: 710-150060GS75000
D30 = CDSOT23-SM712: TVS DIODE 7VWM/12VWM SOT23; Manufacturer: Bourns; Direction: Bidirectional; Capacitance: 75pF; Max Surge Current: 30A; Number of Elements: 2; Reverse Breakdown Voltage: 13.3V; Polarity: Bidirectional,Unidirectional; Clamping Voltage: 19V; Max Power Dissipation: 600W; Working Voltage: 12V; Peak Pulse Power: 400W; Power Line Protection: No; Leakage Current: 20uA; ESD Protection: Yes; Peak Pulse Current: 17A; Test Current: 1mA; Element Configuration: Dual; Diode Type: ZENER; Supplier 1: Mouser; Manufacturer Part Number: CDSOT23-SM712; RoHS: Yes; Category: TVS Diodes; Stock 1: 1112; Pricing 1: 1=1,63000, 10=1,44000, 50=1,44000, 100=1,14000, 250=1,11000, 500=0,94100, 1000=0,74300, 3000=0,69300, 6000=0,67500, 9000=0,62900, 10000=0,62900 (USD); Mount: Surface Mount; Case/Package: SOT-23; Number of Pins: 3; Contact Plating: Tin; Min Operating Temperature: -55°C; Max Operating Temperature: 150°C; Packaging: Tape and Reel; Package Quantity: 1; Number of Channels: 2; Breakdown Voltage: 13.3V; Termination: SMD/SMT; Number of Bidirectional Channels: 2; Reverse Standoff Voltage: 12V; Min Breakdown Voltage: 13.3V; Power Dissipation: 400W; Max Reverse Leakage Current: 20uA; Max Breakdown Voltage: 13.3V; Resistor Type: Zener; Series: -; Length: 3.04mm; Width: 0.055inch; Height: 1.11mm; Depth: 1.4mm; Radiation Hardening: No; REACH SVHC: No SVHC; RoHS Compliant: Yes; ComponentLink1URL: https://datasheet.ciiva.com/1281/1670933-1281331.pdf?src-supplier=Farnell; ComponentLink1Description: https://datasheet.ciiva.com/1281/1670933-1281331.pdf?src-supplier=Farnell; ComponentLink2URL: https://datasheet.ciiva.com/4510/cdsot23-sm712-25932-4510261.pdf?src-supplier=Mouser; ComponentLink2Description: https://datasheet.ciiva.com/4510/cdsot23-sm712-25932-4510261.pdf?src-supplier=Mouser; ComponentLink3URL: https://datasheet.ciiva.com/11193/cdsot23-sm712-11193846.pdf?src-supplier=Avnet; ComponentLink3Description: https://datasheet.ciiva.com/11193/cdsot23-sm712-11193846.pdf?src-supplier=Avnet; ComponentLink4URL: https://datasheet.ciiva.com/22696/1670933-22696779.pdf?src-supplier=Element14; ComponentLink4Description: https://datasheet.ciiva.com/22696/1670933-22696779.pdf?src-supplier=Element14; ComponentLink5URL: https://datasheet.ciiva.com/26828/getdatasheetpartid-418501-26828522.pdf?src-supplier=Verical; ComponentLink5Description: https://datasheet.ciiva.com/26828/getdatasheetpartid-418501-26828522.pdf?src-supplier=Verical; ComponentLink6URL: https://datasheet.ciiva.com/337/cdsot23-sm712-337451.pdf?src-supplier=Digi-Key; ComponentLink6Description: https://datasheet.ciiva.com/337/cdsot23-sm712-337451.pdf?src-supplier=Digi-Key; ComponentLink7URL: https://datasheet.ciiva.com/337/cdsot23-sm712-337452.pdf?src-supplier=Digi-Key; ComponentLink7Description: https://datasheet.ciiva.com/337/cdsot23-sm712-337452.pdf?src-supplier=Digi-Key; Supplier Part Number 1: 652-CDSOT23-SM712
D31-D33 = MBR0530T3G: ON Semi MBR0530T3G; SMT Schottky Diode; 30V 500mA; 2-Pin SOD-123; Manufacturer: ON Semiconductor; Supplier 1: Mouser; Manufacturer Part Number: MBR0530T3G; RoHS: Yes; Category: Schottky Diodes; Stock 1: 167531; Pricing 1: 1=0,19, 10=0,126, 50=0,126, 100=0,065, 1000=0,053, 10000=0,041 (USD); ComponentLink1URL: https://datasheet.ciiva.com/6381/mbr0530t1-d-6381904.pdf?src-supplier=Digikey; ComponentLink1Description: https://datasheet.ciiva.com/6381/mbr0530t1-d-6381904.pdf?src-supplier=Digikey; ComponentLink2URL: https://datasheet.ciiva.com/7962/85890-7962703.pdf?src-supplier=Element14; ComponentLink2Description: https://datasheet.ciiva.com/7962/85890-7962703.pdf?src-supplier=Element14; ComponentLink3URL: https://datasheet.ciiva.com/8294/mbr0530t1-d-8294572.pdf?src-supplier=Avnet; ComponentLink3Description: https://datasheet.ciiva.com/8294/mbr0530t1-d-8294572.pdf?src-supplier=Avnet; ComponentLink4URL: https://datasheet.ciiva.com/15144/getdatasheetpartid-86762-15144599.pdf?src-supplier=Verical; ComponentLink4Description: https://datasheet.ciiva.com/15144/getdatasheetpartid-86762-15144599.pdf?src-supplier=Verical; ComponentLink5URL: https://datasheet.ciiva.com/6381/mbr0530t1-d-6381902.pdf?src-supplier=Digikey; ComponentLink5Description: https://datasheet.ciiva.com/6381/mbr0530t1-d-6381902.pdf?src-supplier=Digikey; Supplier Part Number 1: 863-MBR0530T3G
J5 = 039301180: Molex MiniFit Jr 2x9 Peg Connector Wire to Board Header 18 Position 4.2mm Solder Right Angle Thru-Hole Tray; Supplier 1: Mouser; Manufacturer: Molex; Manufacturer Part Number: 39-30-1180; RoHS: Yes; Category: Headers and Wire Housings; Stock 1: 1289; Pricing 1: 1=2,04, 10=1,55, 50=1,55, 100=1,44, 1000=1,44, 10000=1,39 (USD); Supplier Part Number 1: 538-39-30-1180
Q2-Q4 = IRLML0030TRPBF: MOSFET MOSFT 30V 5.2A 28mOhm 3.6nC Qg; Manufacturer: Infineon Technologies; Configuration: Single; Transistor Type: 1 N-Channel; Forward Transconductance - Min: 9.5 s; Number of Channels: 1 Channel; Transistor Polarity: N-Channel; Channel Mode: Enhancement; Fall Time: 4.4 ns; Id - Continuous Drain Current: 5.3 A; Pd - Power Dissipation: 1.3 W; Qg - Gate Charge: 2.6 nC; Rds On - Drain-Source Resistance: 27 mOhms; Typical Turn-Off Delay Time: 7.4 ns; Typical Turn-On Delay Time: 5.2 ns; Vgs - Gate-Source Voltage: 10 V; Vgs th - Gate-Source Threshold Voltage: 1.3 V; Supplier 1: Mouser; Manufacturer Part Number: IRLML0030TRPBF; RoHS: RoHS Compliant; Category: MOSFET; Stock 1: 29537; Pricing 1: 1=0.360, 10=0.280, 100=0.151, 1000=0.113, 3000=0.098, 9000=0.092 (EUR); Height: 1.1 mm; Length: 2.9 mm; Package / Case: SOT-23-3; Packaging: Cut Tape; Technology: Si; Width: 1.3 mm; Brand: Infineon Technologies; Mounting Style: SMD/SMT; Maximum Operating Temperature: + 150 C; Minimum Operating Temperature: - 55 C; Product Type: MOSFET; Rise Time: 4.4 ns; Standard Pack Qty: 3000; Subcategory: MOSFETs; Vds - Drain-Source Breakdown Voltage: 30 V; RoHS - Mouser: Y; Minimum Order Quantity: 1; Reeling: True; ComponentLink1URL: https://www.mouser.com/datasheet/2/196/irlml0030pbf-1228561.pdf; ComponentLink1Description: https://www.mouser.com/datasheet/2/196/irlml0030pbf-1228561.pdf; Supplier Part Number 1: 942-IRLML0030TRPBF
R92 R93 R104-R106 = RC0402FR-1322RL: as R185 on sheet bolid-inputs-digital; Supplier 1: Mouser; Manufacturer Part Number: RC0402FR-1322RL; RoHS: Yes; Category: Chip SMD Resistors; Stock 1: 130563; Pricing 1: 1=0,10000, 10=0,01200, 50=0,01200, 100=0,00500, 1000=0,00300, 10000=0,00300 (USD); Case/Package: 0402; Case Code (Imperial): 0402; Case Code (Metric): 1005; Weight: 2.3E-05oz; Contact Plating: Tin,Matte; Size Code: 0402; Min Operating Temperature: -55°C; Max Operating Temperature: 155°C; Voltage Rating: 50V; Tolerance: 1%; Packaging: Tape and Reel; Resistor Type: Thick Film; Termination: SMD/SMT; Series: RC; Length: 1mm; Width: 0.5mm; Height: 0.35mm; Radiation Hardening: No; Lead Free: Lead Free; RoHS Compliant: Yes; ComponentLink1URL: https://datasheet.ciiva.com/17423/pyu-rc0402-51-rohs-l-6-r-17423721.pdf?src-supplier=Future+Electronics; ComponentLink1Description: https://datasheet.ciiva.com/17423/pyu-rc0402-51-rohs-l-6-r-17423721.pdf?src-supplier=Future+Electronics; ComponentLink2URL: https://datasheet.ciiva.com/8890/pyu-rc0402-51-rohs-l-6-8890187.pdf?src-supplier=Avnet; ComponentLink2Description: https://datasheet.ciiva.com/8890/pyu-rc0402-51-rohs-l-6-8890187.pdf?src-supplier=Avnet; Supplier Part Number 1: 603-RC0402FR-1322RL
R94 R95 = RC0402FR-1330KL: RES 0402 (1005) 30.0k 1% 0.0625W 50V Thick Film; Manufacturer: Yageo; Resistance: 30kR; Temperature Coefficient: 100ppm/°C; Supplier 1: Mouser; Manufacturer Part Number: RC0402FR-1330KL; Category: Chip SMD Resistors; Stock 1: 14386; Pricing 1: 1=0,10000, 10=0,01700, 50=0,01700, 100=0,00700, 1000=0,00400, 10000=0,00200 (USD); Case/Package: 0402; Contact Plating: Tin; Min Operating Temperature: -55°C; Max Operating Temperature: 155°C; Tolerance: 1%; Resistor Type: Thick Film; Radiation Hardening: No; RoHS Compliant: Yes; ComponentLink1URL: https://datasheet.ciiva.com/8889/pyu-rc0402-51-rohs-l-6-8889740.pdf?src-supplier=Avnet; ComponentLink1Description: https://datasheet.ciiva.com/8889/pyu-rc0402-51-rohs-l-6-8889740.pdf?src-supplier=Avnet; ComponentLink2URL: https://datasheet.octopart.com/RC0402FR-1330KL-Yageo-datasheet-10408619.pdf?src-supplier=_legacy+Avnet; ComponentLink2Description: https://datasheet.octopart.com/RC0402FR-1330KL-Yageo-datasheet-10408619.pdf?src-supplier=_legacy+Avnet; ComponentLink3URL: https://datasheet.octopart.com/RC0402FR-1330KL-Yageo-datasheet-73766026.pdf; ComponentLink3Description: https://datasheet.octopart.com/RC0402FR-1330KL-Yageo-datasheet-73766026.pdf; Supplier Part Number 1: 603-RC0402FR-1330KL
R96-R100 R107-R109 = RC0402FR-0710KL: as R181 on sheet bolid-inputs-digital; Supplier 1: Mouser; Manufacturer Part Number: RC0402FR-0710KL; RoHS: RoHS Compliant; Category: Thick Film Resistors - SMD; Stock 1: 20942447; Pricing 1: 1=0.090, 10=0.011, 100=0.004, 1000=0.003, 10000=0.003 (EUR); Application: High Reliability; Features: -; Height: 0.35 mm; Length: 1 mm; Package / Case: -; Packaging: Cut Tape; Product: Thick Film Resistors SMD; Series: RC; Technology: Thick Film; Termination Style: SMD/SMT; Tolerance: 1 %; Type: General Purpose; Voltage Rating: 50 V; Width: 0.5 mm; Brand: Yageo; Mounting Style: PCB Mount; Case Code - in: 0402; Case Code - mm: 1005; Maximum Operating Temperature: + 155 C; Minimum Operating Temperature: - 55 C; Product Type: Thick Film Resistors; Standard Pack Qty: 10000; Subcategory: Resistors; RoHS - Mouser: Y; Minimum Order Quantity: 1; Reeling: True; ComponentLink1URL: https://www.mouser.com/datasheet/2/447/PYu-RC_Group_51_RoHS_L_10-1664068.pdf; ComponentLink1Description: https://www.mouser.com/datasheet/2/447/PYu-RC_Group_51_RoHS_L_10-1664068.pdf; Supplier Part Number 1: 603-RC0402FR-0710KL
R101-R103 = RC0402FR-07100KL: RES 0402 (1005) 100.0k 1% 0.0625W 50V Thick Film; Manufacturer: Yageo; Power Rating: 62.5 mW, 125 mW; Resistance: 100 kOhms; Temperature Coefficient: 100 PPM / C; Supplier 1: Mouser; Manufacturer Part Number: RC0402FR-07100KL; RoHS: RoHS Compliant; Category: Thick Film Resistors - SMD; Stock 1: 2491111; Pricing 1: 1=0.090, 10=0.011, 100=0.004, 1000=0.003, 10000=0.003 (EUR); Application: High Reliability; Features: -; Height: 0.35 mm; Length: 1 mm; Package / Case: -; Packaging: Cut Tape; Product: Thick Film Resistors SMD; Series: RC; Technology: Thick Film; Termination Style: SMD/SMT; Tolerance: 1 %; Type: General Purpose; Voltage Rating: 50 V; Width: 0.5 mm; Brand: Yageo; Mounting Style: PCB Mount; Case Code - in: 0402; Case Code - mm: 1005; Maximum Operating Temperature: + 155 C; Minimum Operating Temperature: - 55 C; Product Type: Thick Film Resistors; Standard Pack Qty: 10000; Subcategory: Resistors; RoHS - Mouser: Y; Minimum Order Quantity: 1; Reeling: True; ComponentLink1URL: https://www.mouser.com/datasheet/2/447/PYu-RC_Group_51_RoHS_L_10-1664068.pdf; ComponentLink1Description: https://www.mouser.com/datasheet/2/447/PYu-RC_Group_51_RoHS_L_10-1664068.pdf; Supplier Part Number 1: 603-RC0402FR-07100KL
S1-S3 = TX2-12V: Electromechanical Relay 12VDC 1.028KOhm 2A DPDT (15x7.4x8.2)mm THT General Purpose Relay; Manufacturer: Panasonic; Coil Current: 11.7mA; Coil Resistance: 1.028kR; Coil Voltage (DC): 12V; Max Voltage Rating (DC): 220V; Coil Type: Non-Latching; Power Consumption: 140mW; Operate Time: 4ms; Relay Type: Telecom; Insertion Loss: 0.8dB; Number of Poles: 2; Power Rating: 60W; Test Voltage: 2kV; Life (Hours): 1Hour; Pitch: 2.54mm; Hole Diameter: 1mm; Ratings: IP67; Approvals: UL,CSA; Supplier 1: Mouser; Manufacturer Part Number: TX2-12V; RoHS: Yes; Category: Signal Relays; Stock 1: 2161; Pricing 1: 1=3,78000, 10=3,54000, 50=3,15000, 100=3,15000, 1000=2,20000, 10000=2,12000 (USD); Mount: Through Hole,PCB; Case/Package: DIP; Number of Pins: 8; Contact Material: Gold,Silver; Weight: 2g; Contact Plating: Gold; Min Operating Temperature: -40°C; Max Operating Temperature: 85°C; Package Quantity: 40; Packaging: Rail/Tube; Throw Configuration: DPDT; Max Current Rating: 2A; Termination: PC Pin; Series: TX; Contact Current Rating: 2A; Release Time: 4ms; Coil Power: 140mW; Voltage Rating (DC): 220V; Current Rating: 2A; Switching Current: 2A; Length: 15mm; Width: 7.4mm; Height: 8.2mm; Depth: 7.4mm; Lead Pitch: 2.54mm; Radiation Hardening: No; Lead Free: Lead Free; RoHS Compliant: Yes; Reach SVHC Compliant: Yes; ComponentLink1URL: https://datasheet.ciiva.com/26917/getdatasheetpartid-163318-26917772.pdf?src-supplier=Verical; ComponentLink1Description: https://datasheet.ciiva.com/26917/getdatasheetpartid-163318-26917772.pdf?src-supplier=Verical; ComponentLink2URL: https://datasheet.ciiva.com/14532/70158490-14532423.pdf?src-supplier=Allied+Electronics; ComponentLink2Description: https://datasheet.ciiva.com/14532/70158490-14532423.pdf?src-supplier=Allied+Electronics; ComponentLink3URL: https://datasheet.ciiva.com/2416/tx2-relays-2416825.pdf?src-supplier=Digi-Key; ComponentLink3Description: https://datasheet.ciiva.com/2416/tx2-relays-2416825.pdf?src-supplier=Digi-Key; ComponentLink4URL: https://datasheet.ciiva.com/30180/82ds-61022-en-tx-30180027.pdf?src-supplier=Onlinecomponents.com; ComponentLink4Description: https://datasheet.ciiva.com/30180/82ds-61022-en-tx-30180027.pdf?src-supplier=Onlinecomponents.com; Supplier Part Number 1: 769-TX2-12V
U29 = DAC122S085CIMM/NOPB: 12-Bit Micro Power DUAL Digital-to-Analog Converter with ail-to- ail Output 10-VSSOP -40 to 105; Manufacturer: TI National Semiconductor; Supplier 1: Mouser; Manufacturer Part Number: DAC122S085CIMM/NOPB; RoHS: Yes; Category: Digital to Analog Converters (DACs); Stock 1: 2044; Pricing 1: 1=5,24, 10=3,75, 50=3,75, 100=3,36, 1000=3,07, 10000=2,94 (USD); ComponentLink1URL: https://datasheet.ciiva.com/41460/001186508-da-01-en-ic-dac-1-dac122s085cimm-nopb-msop-10-tid-41460669.pdf?src-supplier=Conrad; ComponentLink1Description: https://datasheet.ciiva.com/41460/001186508-da-01-en-ic-dac-1-dac122s085cimm-nopb-msop-10-tid-41460669.pdf?src-supplier=Conrad; ComponentLink2URL: https://datasheet.ciiva.com/3041/dac122s085-3041128.pdf?src-supplier=Avnet; ComponentLink2Description: https://datasheet.ciiva.com/3041/dac122s085-3041128.pdf?src-supplier=Avnet; ComponentLink3URL: https://datasheet.ciiva.com/49118/1851000-49118556.pdf?src-supplier=Element14; ComponentLink3Description: https://datasheet.ciiva.com/49118/1851000-49118556.pdf?src-supplier=Element14; ComponentLink4URL: https://datasheet.ciiva.com/15146/getdatasheetpartid-142727-15146634.pdf?src-supplier=Verical; ComponentLink4Description: https://datasheet.ciiva.com/15146/getdatasheetpartid-142727-15146634.pdf?src-supplier=Verical; ComponentLink5URL: https://datasheet.ciiva.com/6665/dac122s085-6665055.pdf?src-supplier=Digikey; ComponentLink5Description: https://datasheet.ciiva.com/6665/dac122s085-6665055.pdf?src-supplier=Digikey; Supplier Part Number 1: 926-DAC122S085CIMMNO
U30 = OPA2991IDGKR: 40-V, dual 4.5MHz, rail-to-rail input/output, low-offset-voltage, low-noise op amp 8-VSSOP -40 to 125; Manufacturer: Texas Instruments; Supplier 1: Mouser; Manufacturer Part Number: OPA2991IDGKR; RoHS: No; Category: Amplifiers - Op Amps, Buffer, Instrumentation; Stock 1: 17209; Pricing 1: 1=1,92, 10=1,29, 50=1,29, 100=1,13, 1000=0,943, 10000=0,863 (USD); Supplier Part Number 1: 595-OPA2991IDGKR